# EAGLE schematic 152120211104_DoğukanKıyıklık_Hw6 (EAGLE 9.6.2)
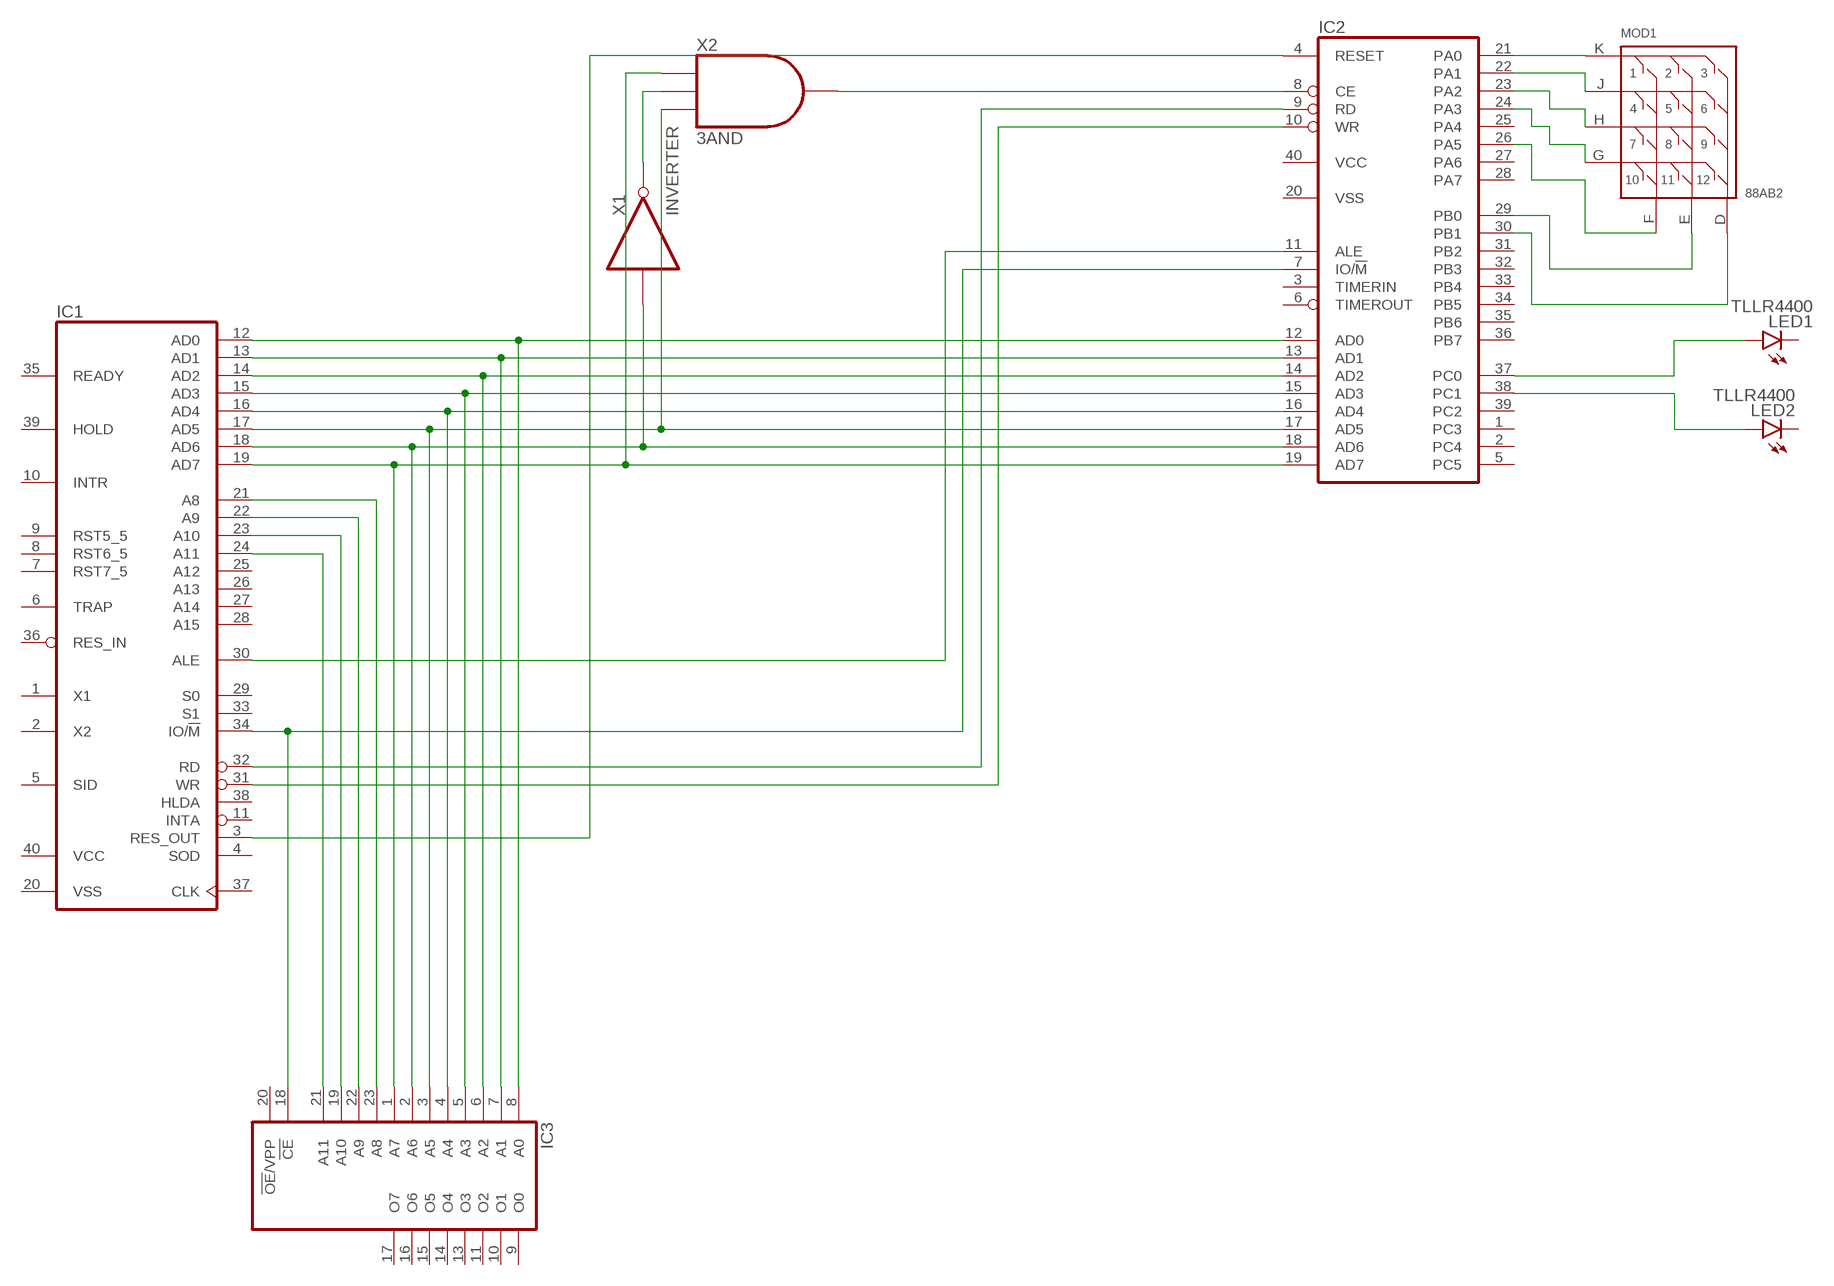
[diagram p0: schematic, sheet 1]

## Parts
IC1  8085  [DIL40]
IC2  8155  [DIL40]
IC3  2732  [DIL24]
LED1  TLLR4400  [LED3MM]
LED2  TLLR4400  [LED3MM]
MOD1  88AB2  [KEYPAD-3X4-REAR-MOUNT]
X1  INVERTER  (no package)
X2  3AND  (no package)

## Nets
N$1: IC1.12(AD0) IC2.12(AD0) IC3.8(A0)
N$2: IC1.13(AD1) IC2.13(AD1) IC3.7(A1)
N$3: IC1.14(AD2) IC2.14(AD2) IC3.6(A2)
N$4: IC1.15(AD3) IC2.15(AD3) IC3.5(A3)
N$5: IC1.16(AD4) IC2.16(AD4) IC3.4(A4)
N$6: IC1.17(AD5) IC2.17(AD5) IC3.3(A5) X2.C
N$7: IC1.18(AD6) IC2.18(AD6) IC3.2(A6) X1.I
N$8: IC1.19(AD7) IC2.19(AD7) IC3.1(A7) X2.A
N$9: IC2.8(CE) X2.Y
N$10: IC2.38(PC1) LED2.A
N$11: IC2.37(PC0) LED1.A
N$12: IC1.31(WR) IC2.10(WR)
N$13: X1.O X2.B
N$15: IC1.3(RES_OUT) IC2.4(RESET)
N$16: IC1.32(RD) IC2.9(RD)
N$17: IC1.34(IO/!M) IC2.7(IO/!M) IC3.18(!CE)
N$18: IC1.30(ALE) IC2.11(ALE)
N$19: IC1.24(A11) IC3.21(A11)
N$20: IC1.23(A10) IC3.19(A10)
N$21: IC1.22(A9) IC3.22(A9)
N$22: IC1.21(A8) IC3.23(A8)
N$25: IC2.21(PA0) MOD1.K
N$26: IC2.22(PA1) MOD1.J
N$27: IC2.23(PA2) MOD1.H
N$28: IC2.24(PA3) MOD1.G
N$29: IC2.26(PA5) MOD1.F
N$30: IC2.29(PB0) MOD1.E
N$31: IC2.30(PB1) MOD1.D
Unconnected: IC1.1(X1) IC1.2(X2) IC1.4(SOD) IC1.5(SID) IC1.6(TRAP) IC1.7(RST7_5) IC1.8(RST6_5) IC1.9(RST5_5) IC1.10(INTR) IC1.11(INTA) IC1.25(A12) IC1.26(A13) IC1.27(A14) IC1.28(A15) IC1.29(S0) IC1.33(S1) IC1.35(READY) IC1.36(RES_IN) IC1.37(CLK) IC1.38(HLDA) IC1.39(HOLD) IC2.1(PC3) IC2.2(PC4) IC2.3(TIMERIN) IC2.5(PC5) IC2.6(TIMEROUT) IC2.25(PA4) IC2.27(PA6) IC2.28(PA7) IC2.31(PB2) IC2.32(PB3) IC2.33(PB4) IC2.34(PB5) IC2.35(PB6) IC2.36(PB7) IC2.39(PC2) IC3.9(O0) IC3.10(O1) IC3.11(O2) IC3.13(O3) IC3.14(O4) IC3.15(O5) IC3.16(O6) IC3.17(O7) IC3.20(!OE!/VPP) LED1.K(C) LED2.K(C)

## Power pins joined to a net without a drawn wire
GND: IC3.12(GND)
VCC: IC1.40(VCC) IC2.40(VCC) IC3.24(VCC)
VSS: IC1.20(VSS) IC2.20(VSS)

## Library data of the parts
IC1 = micro-intel:8085: MICROCOMPUTER/PERIPHERAL DEVICE; OC_FARNELL: unknown; OC_NEWARK: unknown
IC2 = micro-intel:8155: MICROCOMPUTER/PERIPHERAL DEVICE; OC_FARNELL: unknown; OC_NEWARK: unknown
IC3 = memory:2732: MEMORY
LED1 LED2 = led:TLLR4400: Low Current (2mA) LED 3 mm Tinted Diffused Package color RED Source: Data sheet <http://www.farnell.com/datasheets/391100.pdf>; MF: VISHAY SEMICONDUCTOR; OC_FARNELL: 1612437
MOD1 = 88AB2:88AB2: Keypad 3x4 matrix Check availability <https://pricing.snapeda.com/parts/88AB2/Grayhill/view-part?ref=eda>; AVAILABILITY: In Stock; CHECK_PRICES: https://www.snapeda.com/parts/88AB2/Grayhill/view-part/?ref=eda; DESCRIPTION: Keypad, 3 x 4 in., Blank | Grayhill 88AB2; MF: Grayhill; MP: 88AB2; PACKAGE: None; PRICE: None; SNAPEDA_LINK: https://www.snapeda.com/parts/88AB2/Grayhill/view-part/?ref=snap
X1 = ngspice-digital:INVERTER: logic inverter (NOT gate)
X2 = ngspice-digital:3AND: 3 input logic AND gate